# Altium schematic sheet LVDS.SchDoc
size 420 x 297 mm; DocumentNumber: 8; SheetNumber: 9; SheetTotal: 17
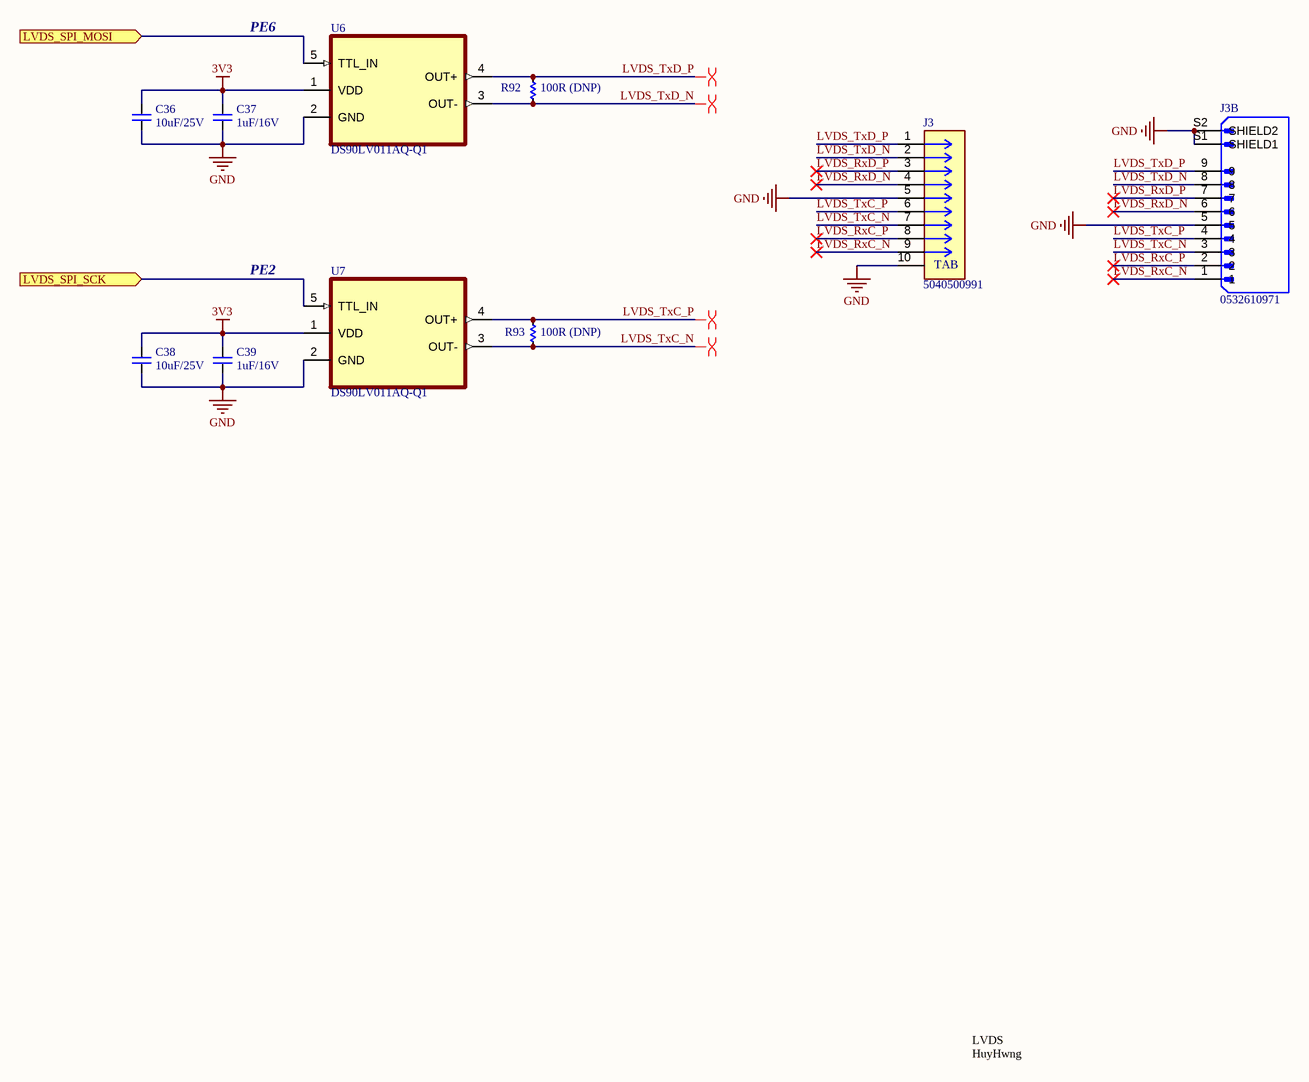
[diagram p0: LVDS.SchDoc]

## Parts
C36  10uF/25V  [CAP_C_1608X80]
C37  1uF/16V  [CAP_C_1608X80]
C38  10uF/25V  [CAP_C_1608X80]
C39  1uF/16V  [CAP_C_1608X80]
J3  5040500991  [5040500991]
J3B  0532610971  [0532610971]
R92  100R (DNP)  [RES_C_1608X60]
R93  100R (DNP)  [RES_C_1608X60]
U6  DS90LV011AQ-Q1  [DS90LV011AQ-Q1]
U7  DS90LV011AQ-Q1  [DS90LV011AQ-Q1]

## Ports
LVDS_SPI_MOSI (in), LVDS_SPI_SCK (in)

## Nets
3V3: C36.2 C37.2 C38.2 C39.2 U6.1(VDD) U7.1(VDD)
GND: C36.1 C37.1 C38.1 C39.1 J3.5 J3.10 J3B.5 J3B.S1(SHIELD1) J3B.S2(SHIELD2) U6.2(GND) U7.2(GND)
LVDS_RxC_N: J3.9 J3B.1
LVDS_RxC_P: J3.8 J3B.2
LVDS_RxD_N: J3.4 J3B.6
LVDS_RxD_P: J3.3 J3B.7
LVDS_SPI_MOSI: U6.5(TTL_IN) ; port LVDS_SPI_MOSI
LVDS_SPI_SCK: U7.5(TTL_IN) ; port LVDS_SPI_SCK
LVDS_TxC_N: J3.7 J3B.3 R93.1 U7.3(OUT-)
LVDS_TxC_P: J3.6 J3B.4 R93.2 U7.4(OUT+)
LVDS_TxD_N: J3.2 J3B.8 R92.1 U6.3(OUT-)
LVDS_TxD_P: J3.1 J3B.9 R92.2 U6.4(OUT+)

## Layout directives
differential pair: LVDS_TxC_N, LVDS_TxC_P, LVDS_TxD_N, LVDS_TxD_P

## Notes on the sheet
- PE6
- PE2
- LVDS
- HuyHwng
- Project:
- BEE-PC1
- Sub-system:
- NANORACK_EXP_CONTROLLER
- Design by:
- SANG HUYNH
- BAO BUI Q.
- Sheet title:
- Sheet
- A3
- of
- Checked by:
- Approved by:
- VU PHAM
- Revision:
- Document No:
- V1.2.2
- Size:
- Date:
- (in symbol 5040500991) TAB

## Library data of the parts
C36-C39 = CAP_SMD: CAP_Chip; Value: 33pF
J3 = 5040500991: Connector Header Surface Mount, Right Angle 9 position 0.059" (1.50mm)
J3B = CONN_SMD_09: CONN HEADER SMD R/A 9POS 1.25MM
R92 R93 = _RES_B_2: RES
U6 U7 = DS90LV011AQ-Q1: Automotive LVDS Differential Driver